# Altium project PCB Version 0.4.PrjPcb
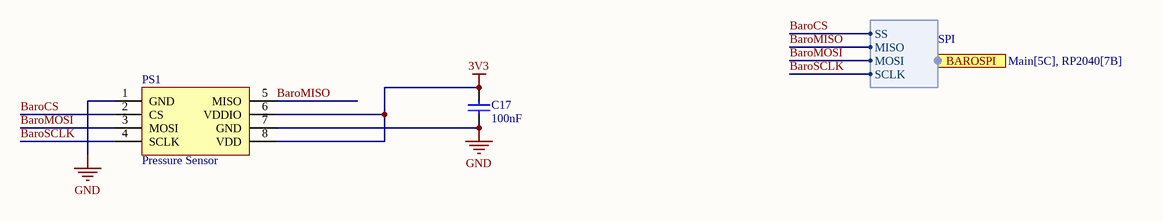
[diagram p0: Baro.SchDoc]
8 sheets, 151 parts. Net scope: flat (ports and power ports of the same name join across sheets).
Board file: PCB v0.4.PcbDoc
Sheets:
  Baro.SchDoc
  Connectors.SchDoc
  ELRS.SchDoc
  OSD.SchDoc
  RP2040.SchDoc
  SD.SchDoc
  USB.SchDoc
  Voltage Regulators.SchDoc

## Sheet Baro.SchDoc
size A4; SheetNumber: 2; SheetTotal: 13

### Parts
C17  100nF  [0402 cap]
PS1  Pressure Sensor  [Goertek SPL06-001]

### Ports
BAROSPI (harness SPI, see Main[5C], RP2040[7B])

### Harnesses
SPI: SS, MISO, MOSI, SCLK

### Nets
3V3: C17.2 PS1.6(VDDIO) PS1.8(VDD)
GND: C17.1 PS1.1(GND) PS1.7(GND)
BaroCS: PS1.2(CS) ; port BAROSPI.SS  [project net BARO_SS]
BaroMISO: PS1.5(MISO) ; port BAROSPI.MISO
BaroMOSI: PS1.3(MOSI) ; port BAROSPI.MOSI
BaroSCLK: PS1.4(SCLK) ; port BAROSPI.SCLK

### Library data of the parts
C17 = Capacitor 0402 100nF: Value: 100nF
PS1 = Goertek SPL06-001

## Sheet Connectors.SchDoc
size A4; SheetNumber: 3; SheetTotal: 13
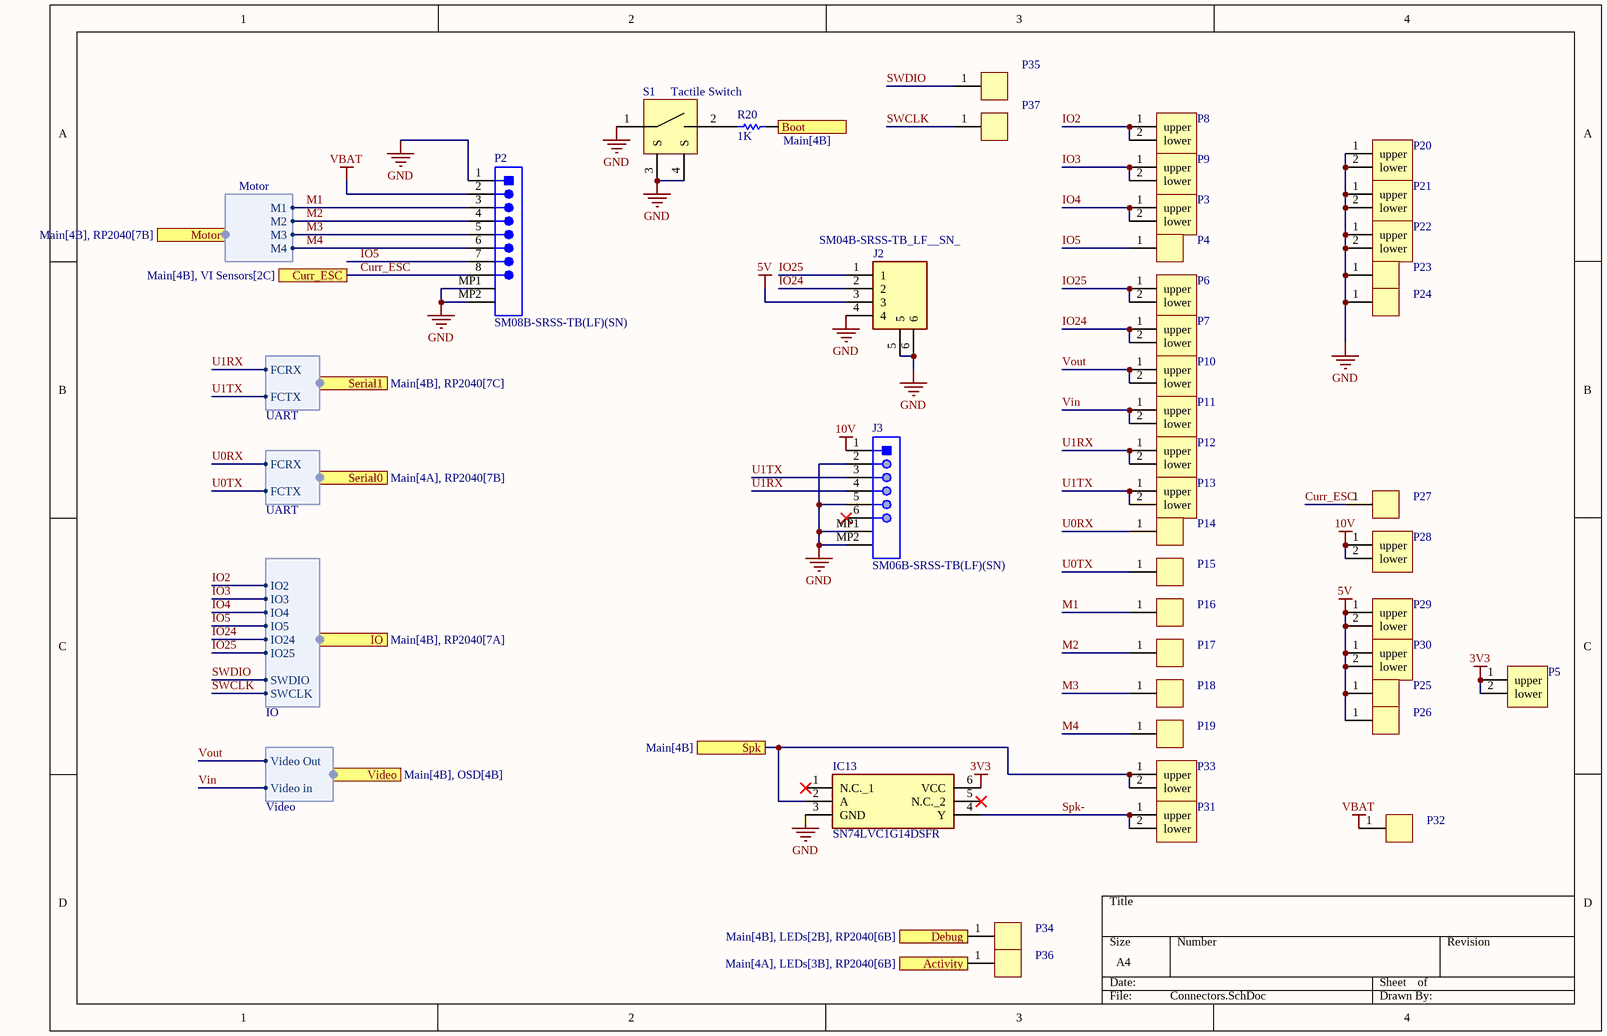
[diagram p1: Connectors.SchDoc]

### Parts
IC13  SN74LVC1G14DSFR  [SON35P100X100X40-6N]
J2  SM04B-SRSS-TB_LF__SN_  [SM04B-SRSS-TB(LFSN)]
J3  SM06B-SRSS-TB(LF)(SN)  [JST-SM06B-SRSS-TB_V]
P2  SM08B-SRSS-TB(LF)(SN)  [JST-SM08B-SRSS-TB_V]
P3  solder pad rounded double sided  [solder pad double sided rounded - duplicate]  (value not drawn)
P4  solder pad rounded single sided  [solder pad single sided rounded]  (value not drawn)
P5  solder pad chamfered double sided  [solder pad double sided chamfered]  (value not drawn)
P6  solder pad rounded double sided  [solder pad double sided rounded - duplicate]  (value not drawn)
P7  solder pad rounded double sided  [solder pad double sided rounded - duplicate]  (value not drawn)
P8  solder pad rounded double sided  [solder pad double sided rounded - duplicate]  (value not drawn)
P9  solder pad rounded double sided  [solder pad double sided rounded - duplicate]  (value not drawn)
P10  solder pad rounded double sided  [solder pad double sided rounded - duplicate]  (value not drawn)
P11  solder pad rounded double sided  [solder pad double sided rounded - duplicate]  (value not drawn)
P12  solder pad rounded double sided  [solder pad double sided rounded - duplicate]  (value not drawn)
P13  solder pad rounded double sided  [solder pad double sided rounded - duplicate]  (value not drawn)
P14  solder pad rounded single sided  [solder pad single sided rounded]  (value not drawn)
P15  solder pad rounded single sided  [solder pad single sided rounded]  (value not drawn)
P16  solder pad rounded single sided  [solder pad single sided rounded]  (value not drawn)
P17  solder pad rounded single sided  [solder pad single sided rounded]  (value not drawn)
P18  solder pad rounded single sided  [solder pad single sided rounded]  (value not drawn)
P19  solder pad rounded single sided  [solder pad single sided rounded]  (value not drawn)
P20  solder pad square double sided  [solder pad double sided square]  (value not drawn)
P21  solder pad square double sided  [solder pad double sided square]  (value not drawn)
P22  solder pad square double sided  [solder pad double sided square]  (value not drawn)
P23  solder pad square single sided  [solder pad single sided square]  (value not drawn)
P24  solder pad square single sided  [solder pad single sided square]  (value not drawn)
P25  solder pad chamfered single sided  [solder pad single sided chamfered]  (value not drawn)
P26  solder pad chamfered single sided  [solder pad single sided chamfered]  (value not drawn)
P27  solder pad rounded single sided  [solder pad single sided rounded]  (value not drawn)
P28  solder pad chamfered double sided  [solder pad double sided chamfered]  (value not drawn)
P29  solder pad chamfered double sided  [solder pad double sided chamfered]  (value not drawn)
P30  solder pad chamfered double sided  [solder pad double sided chamfered]  (value not drawn)
P31  solder pad rounded double sided  [solder pad double sided rounded - duplicate]  (value not drawn)
P32  solder pad chamfered single sided  [solder pad single sided chamfered]  (value not drawn)
P33  solder pad rounded double sided  [solder pad double sided rounded - duplicate]  (value not drawn)
P34  solder pad rounded single sided  [solder pad single sided rounded]  (value not drawn)
P35  solder pad rounded single sided  [solder pad single sided rounded]  (value not drawn)
P36  solder pad rounded single sided  [solder pad single sided rounded]  (value not drawn)
P37  solder pad rounded single sided  [solder pad single sided rounded]  (value not drawn)
R20  1K  [RESC0603(1608)_N]
S1  Tactile Switch  [Tactile Switch]

### Ports
Activity (see Main[4A], LEDs[3B], RP2040[6B]), Boot (see Main[4B]), Curr_ESC (see Main[4B], VI Sensors[2C]), Debug (see Main[4B], LEDs[2B], RP2040[6B]), IO (harness IO, see Main[4B], RP2040[7A]), Motor (harness Motor, see Main[4B], RP2040[7B]), Serial0 (harness UART, see Main[4A], RP2040[7B]), Serial1 (harness UART, see Main[4B], RP2040[7C]), Spk (see Main[4B]), Video (harness Video, see Main[4B], OSD[4B])

### Harnesses
Motor: M1, M2, M3, M4
UART: FCRX, FCTX
IO: IO24, IO25, SWDIO, SWCLK, IO4, IO5, IO2, IO3
Video: Video Out, Video in

### Nets
3V3: IC13.6(VCC) P5.1(upper) P5.2(lower)
5V: J2.3 P25.1(upper) P26.1(upper) P29.1(upper) P29.2(lower) P30.1(upper) P30.2(lower)
10V: J3.1 P28.1(upper) P28.2(lower)
GND: IC13.3(GND) J2.4 J2.5 J2.6 J3.2 J3.5 J3.MP1 J3.MP2 P2.1 P2.MP1 P2.MP2 P20.1(upper) P20.2(lower) P21.1(upper) P21.2(lower) P22.1(upper) P22.2(lower) P23.1(upper) P24.1(upper) S1.1 S1.3(S) S1.4(S)
VBAT: P2.2 P32.1(upper)
Activity: P36.1(upper) ; port Activity
Curr_ESC: P2.8 P27.1(upper) ; port Curr_ESC
Debug: P34.1(upper) ; port Debug
IO2: P8.1(upper) P8.2(lower) ; port IO.IO2
IO3: P9.1(upper) P9.2(lower) ; port IO.IO3
IO4: P3.1(upper) P3.2(lower) ; port IO.IO4
IO5: P2.7 P4.1(upper) ; port IO.IO5
IO24: J2.2 P7.1(upper) P7.2(lower) ; port IO.IO24
IO25: J2.1 P6.1(upper) P6.2(lower) ; port IO.IO25
M1: P2.3 P16.1(upper) ; port Motor.M1
M2: P2.4 P17.1(upper) ; port Motor.M2
M3: P2.5 P18.1(upper) ; port Motor.M3
M4: P2.6 P19.1(upper) ; port Motor.M4
Spk-: IC13.4(Y) P31.1(upper) P31.2(lower)
SWCLK: P37.1(upper) ; port IO.SWCLK
SWDIO: P35.1(upper) ; port IO.SWDIO
U0RX: P14.1(upper) ; port Serial0.FCRX
U0TX: P15.1(upper) ; port Serial0.FCTX
U1RX: J3.4 P12.1(upper) P12.2(lower) ; port Serial1.FCRX
U1TX: J3.3 P13.1(upper) P13.2(lower) ; port Serial1.FCTX
Vin: P11.1(upper) P11.2(lower) ; port Video.Video in  [project net Video In]
Vout: P10.1(upper) P10.2(lower) ; port Video.Video Out  [project net Video Out]
NetIC13_2: IC13.2(A) P33.1(upper) P33.2(lower) ; port Spk
NetR20_1: R20.1 S1.2
NetR20_2: R20.2 ; port Boot

Not connected (* = marked no-connect by the designer): IC13 1(N.C._1)* 5(N.C._2)*; J3 6*

### Library data of the parts
IC13 = SN74LVC1G14DSFR: Integrated Circuit; Manufacturer_Name: Texas Instruments; Datasheet Link: https://www.ti.com/lit/ds/symlink/sn74lvc1g14.pdf?HQS=dis-dk-null-digikeymode-dsf-pf-null-wwe&ts=1640194498042&ref_url=https%253A%252F%252Fwww.ti.com%252Fgeneral%252Fdocs%252Fsuppproductinfo.tsp%253FdistId%253D10%2526gotoUrl%253Dhttps%253A%252F%252Fwww.ti; Height: 0.4mm; Manufacturer_Part_Number: SN74LVC1G14DSFR; Mouser Part Number: 595-SN74LVC1G14DSFR; Mouser Price/Stock: https://www.mouser.co.uk/ProductDetail/Texas-Instruments/SN74LVC1G14DSFR?qs=L4ss%2FyqpMWRLGwmM%2Fw1SHQ%3D%3D; Arrow Part Number: SN74LVC1G14DSFR; Arrow Price/Stock: https://www.arrow.com/en/products/sn74lvc1g14dsfr/texas-instruments?region=nac
J2 = SM04B-SRSS-TB_LF__SN_: Connector; Manufacturer_Name: JST (JAPAN SOLDERLESS TERMINALS); Manufacturer_Part_Number: SM04B-SRSS-TB(LF)(SN); Datasheet Link: http://www.jst-mfg.com/product/pdf/eng/eSH.pdf; Arrow Part Number: SM04B-SRSS-TB(LF)(SN); Arrow Price/Stock: https://www.arrow.com/en/products/sm04b-srss-tb-lf-sn/jst-manufacturing?region=europe
J3 = CMP-2000-07080-1: Male Header, Pitch 1 mm, 1 x 6 Position, Height 2.95 mm, -25 to 85 degC, RoHS, Tape and Reel; Manufacturer: JST; No of Positions: 6; Pitch: 1mm; Style/Orientation: RightAngleHeader/Plug; Datasheet URL: https://datasheet.ciiva.com/26894/getdatasheetpartid-708885-26894671.pdf; Package Description: Male Header, Pitch 1 mm, 1 X 6 Position, Height 2.9 mm; Termination: Solder; Manufacturer URL: http://www.jst.com/home2.html; Type: ShroudedHeader; Package Reference: SM06B-SRSS-TB; Datasheet Version: 11/2010; Mounting Technology: SurfaceMount
P2 = CMP-2000-07082-1: Male Header, Pitch 1 mm, 1 x 8 Position, Height 2.95 mm, -25 to 85 degC, RoHS, Tape and Reel; Manufacturer: JST; Style/Orientation: RightAngleHeader/Plug; Pitch: 1mm; No of Positions: 8; Manufacturer URL: http://www.jst.com/home2.html; Mounting Technology: SurfaceMount; Package Description: Male Header, Pitch 1 mm, 1 x 8 Position, Height 2.95 mm; Datasheet URL: http://www.jst-mfg.com/product/pdf/eng/eSR.pdf; Type: ShroudedHeader; Termination: Crimp; Package Reference: SM08B-SRSS-TB; Datasheet Version: 11/2010
R20 = Res 1K: Chipwiderstand, SMD, Baureihe MC, 1%; Manufacturer: Multicomp; PackageReference: 0603; Value: 1K; OC_FARNELL: 9330380

## Sheet ELRS.SchDoc
size A3; SheetNumber: 4; SheetTotal: 13; SPICEModelCacheIXSEWQWZ: <root> / <DocumentId>IXSEWQWZ</DocumentId> / <CacheFrame Number="0"> / <Model Name="0603_885012106031_10uf" Kind="CKT"> / <Text>******* / .subckt 0603_885012106031_10uF 1 2 / Rser 1 3 0.0105 / Lser 2 4 0.0000000008 / C1 3 4 0.00001 / Rpar 3 4 10000000 / .ends 0603_885012106031_10uF</Text> / </Model> / </CacheFrame> / </root>
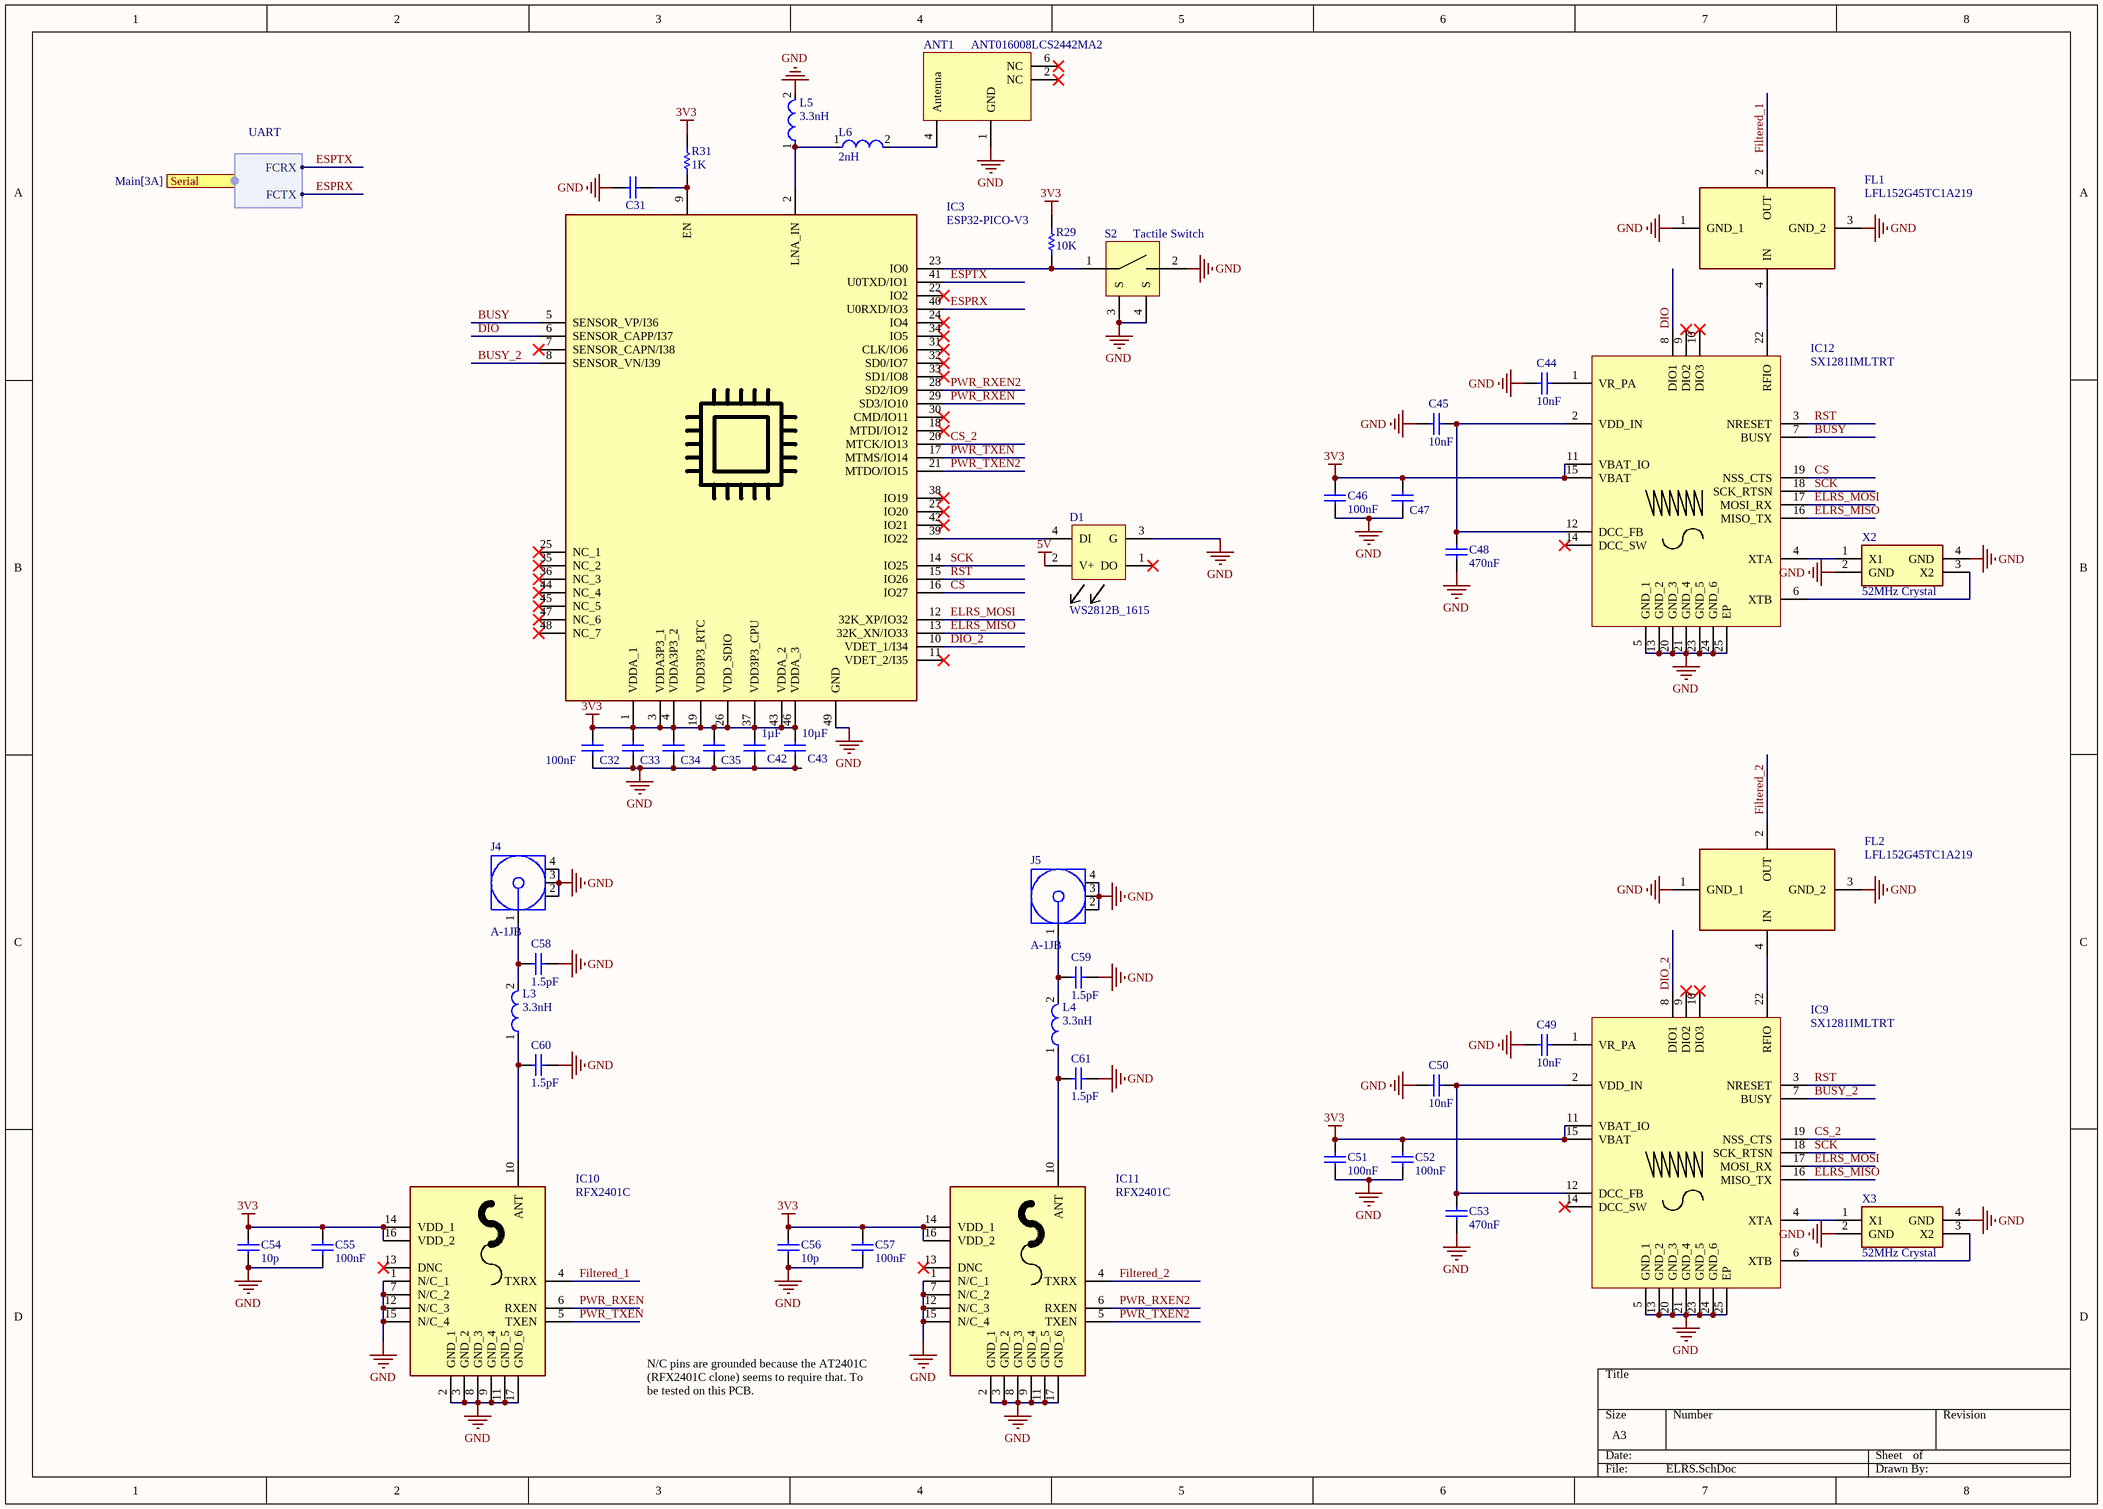
[diagram p2: ELRS.SchDoc]

### Parts
ANT1  ANT016008LCS2442MA2  [ANT016008LCS2442MA2]
C31  100nF  [WCAP-CSGP_0603_L1.6W0.8H0.8_Reflow]  (value not drawn)
C32  100nF  [WCAP-CSGP_0603_L1.6W0.8H0.8_Reflow]
C33  100nF  [WCAP-CSGP_0603_L1.6W0.8H0.8_Reflow]  (value not drawn)
C34  100nF  [WCAP-CSGP_0603_L1.6W0.8H0.8_Reflow]  (value not drawn)
C35  100nF  [WCAP-CSGP_0603_L1.6W0.8H0.8_Reflow]  (value not drawn)
C42  1µF  [WCAP-CSGP_0603_L1.6W0.8H0.8_Reflow]
C43  10µF  [WCAP-CSGP_0603_L1.6W0.8H0.8_Reflow]
C44  10nF  [0402 cap]
C45  10nF  [0402 cap]
C46  100nF  [0402 cap]
C47  100nF  [WCAP-CSGP_0603_L1.6W0.8H0.8_Reflow]  (value not drawn)
C48  470nF  [0402 cap]
C49  10nF  [0402 cap]
C50  10nF  [0402 cap]
C51  100nF  [0402 cap]
C52  100nF  [0402 cap]
C53  470nF  [0402 cap]
C54  10p  [0402 cap]
C55  100nF  [0402 cap]
C56  10p  [0402 cap]
C57  100nF  [0402 cap]
C58  1.5pF  [0402 cap]
C59  1.5pF  [0402 cap]
C60  1.5pF  [0402 cap]
C61  1.5pF  [0402 cap]
D1  WS2812B_1615  [WS2812B_1615]
FL1  LFL152G45TC1A219  [LFL152G45TC1A219]
FL2  LFL152G45TC1A219  [LFL152G45TC1A219]
IC3  ESP32-PICO-V3  [ESP32PICOV3]
IC9  SX1281IMLTRT  [QFN50P400X400X100-25N-D]
IC10  RFX2401C  [QFN50P300X300X60-17N-D]
IC11  RFX2401C  [QFN50P300X300X60-17N-D]
IC12  SX1281IMLTRT  [QFN50P400X400X100-25N-D]
J4  A-1JB  [AMPH-A-1JB_V]
J5  A-1JB  [AMPH-A-1JB_V]
L3  3.3nH  [FP-LQW15AN_00-W0_6-0_1-MFG]
L4  3.3nH  [FP-LQW15AN_00-W0_6-0_1-MFG]
L5  3.3nH  [FP-LQW15AN_00-W0_6-0_1-MFG]
L6  2nH  [FP-LQW15AN_00-W0_6-0_1-MFG]
R29  10K  [0402 resistor]
R31  1K  [0402 resistor]
S2  Tactile Switch  [Tactile Switch]
X2  52MHz Crystal  [2016 Crystal]
X3  52MHz Crystal  [2016 Crystal]

### Ports
Serial (harness UART, see Main[3A])

### Harnesses
UART: FCRX, FCTX

### Nets
3V3: C32.2 C33.2 C34.2 C35.2 C42.2 C43.2 C46.2 C47.2 C51.2 C52.2 C54.2 C55.2 C56.2 C57.2 IC3.1(VDDA_1) IC3.3(VDDA3P3_1) IC3.4(VDDA3P3_2) IC3.19(VDD3P3_RTC) IC3.26(VDD_SDIO) IC3.37(VDD3P3_CPU) IC3.43(VDDA_2) IC3.46(VDDA_3) IC9.11(VBAT_IO) IC9.15(VBAT) IC10.14(VDD_1) IC10.16(VDD_2) IC11.14(VDD_1) IC11.16(VDD_2) IC12.11(VBAT_IO) IC12.15(VBAT) R29.2 R31.2
5V: D1.2(V+)
GND: ANT1.1(GND) C31.2 C32.1 C33.1 C34.1 C35.1 C42.1 C43.1 C44.1 C45.1 C46.1 C47.1 C48.1 C49.1 C50.1 C51.1 C52.1 C53.1 C54.1 C55.1 C56.1 C57.1 C58.2 C59.2 C60.2 C61.2 D1.3(G) FL1.1(GND_1) FL1.3(GND_2) FL2.1(GND_1) FL2.3(GND_2) IC3.49(GND) IC9.5(GND_1) IC9.13(GND_2) IC9.20(GND_3) IC9.21(GND_4) IC9.23(GND_5) IC9.24(GND_6) IC9.25(EP) IC10.1(N/C_1) IC10.2(GND_1) IC10.3(GND_2) IC10.7(N/C_2) IC10.8(GND_3) IC10.9(GND_4) IC10.11(GND_5) IC10.12(N/C_3) IC10.15(N/C_4) IC10.17(GND_6) IC11.1(N/C_1) IC11.2(GND_1) IC11.3(GND_2) IC11.7(N/C_2) IC11.8(GND_3) IC11.9(GND_4) IC11.11(GND_5) IC11.12(N/C_3) IC11.15(N/C_4) IC11.17(GND_6) IC12.5(GND_1) IC12.13(GND_2) IC12.20(GND_3) IC12.21(GND_4) IC12.23(GND_5) IC12.24(GND_6) IC12.25(EP) J4.2 J4.3 J4.4 J5.2 J5.3 J5.4 L5.2 S2.2 S2.3(S) S2.4(S) X2.2(GND) X2.4(GND) X3.2(GND) X3.4(GND)
BUSY: IC3.5(SENSOR_VP/I36) IC12.7(BUSY)
BUSY_2: IC3.8(SENSOR_VN/I39) IC9.7(BUSY)
CS: IC3.16(IO27) IC12.19(NSS_CTS)
CS_2: IC3.20(MTCK/IO13) IC9.19(NSS_CTS)
DIO: IC3.6(SENSOR_CAPP/I37) IC12.8(DIO1)
DIO_2: IC3.10(VDET_1/I34) IC9.8(DIO1)
ELRS_MISO: IC3.13(32K_XN/IO33) IC9.16(MISO_TX) IC12.16(MISO_TX)
ELRS_MOSI: IC3.12(32K_XP/IO32) IC9.17(MOSI_RX) IC12.17(MOSI_RX)
ESPRX: IC3.40(U0RXD/IO3) ; port Serial.FCTX
ESPTX: IC3.41(U0TXD/IO1) ; port Serial.FCRX
Filtered_1: FL1.2(OUT) IC10.4(TXRX)
Filtered_2: FL2.2(OUT) IC11.4(TXRX)
PWR_RXEN: IC3.29(SD3/IO10) IC10.6(RXEN)
PWR_RXEN2: IC3.28(SD2/IO9) IC11.6(RXEN)
PWR_TXEN: IC3.17(MTMS/IO14) IC10.5(TXEN)
PWR_TXEN2: IC3.21(MTDO/IO15) IC11.5(TXEN)
RST: IC3.15(IO26) IC9.3(NRESET) IC12.3(NRESET)
SCK: IC3.14(IO25) IC9.18(SCK_RTSN) IC12.18(SCK_RTSN)
NetANT1_4: ANT1.4(Antenna) L6.2
NetC31_1: C31.1 IC3.9(EN) R31.1
NetC44_2: C44.2 IC12.1(VR_PA)
NetC45_2: C45.2 C48.2 IC12.2(VDD_IN) IC12.12(DCC_FB)
NetC49_2: C49.2 IC9.1(VR_PA)
NetC50_2: C50.2 C53.2 IC9.2(VDD_IN) IC9.12(DCC_FB)
NetC58_1: C58.1 J4.1 L3.2
NetC59_1: C59.1 J5.1 L4.2
NetC60_1: C60.1 IC10.10(ANT) L3.1
NetC61_1: C61.1 IC11.10(ANT) L4.1
NetD1_4: D1.4(DI) IC3.39(IO22)
NetFL1_4: FL1.4(IN) IC12.22(RFIO)
NetFL2_4: FL2.4(IN) IC9.22(RFIO)
NetIC3_2: IC3.2(LNA_IN) L5.1 L6.1
NetIC3_23: IC3.23(IO0) R29.1 S2.1
NetIC9_4: IC9.4(XTA) X3.1(X1)
NetIC9_6: IC9.6(XTB) X3.3(X2)
NetIC12_4: IC12.4(XTA) X2.1(X1)
NetIC12_6: IC12.6(XTB) X2.3(X2)

Not connected (* = marked no-connect by the designer): ANT1 2(NC)* 6(NC)*; D1 1(DO)*; IC3 7(SENSOR_CAPN/I38)* 11(VDET_2/I35)* 18(MTDI/IO12)* 22(IO2)* 24(IO4)* 25(NC_1)* 27(IO20)* 30(CMD/IO11)* 31(CLK/IO6)* 32(SD0/IO7)* 33(SD1/IO8)* 34(IO5)* 35(NC_2)* 36(NC_3)* 38(IO19)* 42(IO21)* 44(NC_4)* 45(NC_5)* 47(NC_6)* 48(NC_7)*; IC9 9(DIO2)* 10(DIO3)* 14(DCC_SW)*; IC10 13(DNC)*; IC11 13(DNC)*; IC12 9(DIO2)* 10(DIO3)* 14(DCC_SW)*

### Notes on the sheet
- N/C pins are grounded because the AT2401C (RFX2401C clone) seems to require that. To be tested on this PCB.

### Library data of the parts
ANT1 = ANT016008LCS2442MA2: Antenna; Manufacturer_Name: TDK; Datasheet Link: https://product.tdk.com/system/files/dam/doc/product/rf/rf/antenna/catalog/rf_ant_ant016008lcs2442ma2_summary_en.pdf; Height: 0.4mm; Manufacturer_Part_Number: ANT016008LCS2442MA2; Mouser Part Number: 810-ANT168LCS2442MA2; Mouser Price/Stock: https://www.mouser.co.uk/ProductDetail/TDK/ANT016008LCS2442MA2?qs=NlTBjZZh8j0h3jcBIFCiDg%3D%3D; Arrow Part Number: ANT016008LCS2442MA2; Arrow Price/Stock: https://www.arrow.com/en/products/ant016008lcs2442ma2/tdk
C31-C35 C47 = 885012206095: WCAP-CSGP Multilayer Ceramic Chip Capacitor, General Purpose, size 0603, X7R, 100nF, 50VDC; Manufacturer: Wurth Elektronik; Case/Size Code: 0603; Capacitance Tolerance: +/-10%; Dissipation Factor: 3%; Insulation Resistance: 5GΩ; Rated Voltage (DC): 50V; Technical Reference: X7R0603104K050DFCT10000; Manufacturer Part Number: 885012206095; Category: Multilayer Ceramic Chip Capacitors; Match Code: WCAP-CSGP; ComponentLink1Description: Website Link; ComponentLink1URL: https://www.we-online.com/redexpert/article/885012206095?ad; ComponentLink2Description: Datasheet Link; ComponentLink2URL: https://www.we-online.com/redexpert/spec/885012206095?ad; Mount: Surface Mount; Operating Temperature Max: 125°C; Operating Temperature Min: -55°C; Packaging: Tape and Reel; Length: 1.6mm; Width: 0.8mm; Height: 0.8mm; Capacitance: 100nF; Ceramic Type: X7R
C42 = 885012206076: WCAP-CSGP Multilayer Ceramic Chip Capacitor, General Purpose, size 0603, X7R, 1µF, 25VDC; Manufacturer: Wurth Elektronik; Case/Size Code: 0603; Capacitance Tolerance: +/-10%; Dissipation Factor: 10%; Insulation Resistance: 0.5GΩ; Rated Voltage (DC): 25V; Technical Reference: X7R0603105K025DFCT10000; Manufacturer Part Number: 885012206076; Category: Multilayer Ceramic Chip Capacitors; Match Code: WCAP-CSGP; ComponentLink1Description: Website Link; ComponentLink1URL: https://www.we-online.com/redexpert/article/885012206076?ad; ComponentLink2Description: Datasheet Link; ComponentLink2URL: https://www.we-online.com/redexpert/spec/885012206076?ad; Mount: Surface Mount; Operating Temperature Max: 125°C; Operating Temperature Min: -55°C; Packaging: Tape and Reel; Length: 1.6mm; Width: 0.8mm; Height: 0.8mm; Capacitance: 1µF; Ceramic Type: X7R
C43 = 885012106031: WCAP-CSGP Multilayer Ceramic Chip Capacitor, General Purpose, size 0603, X5R, 10µF, 25VDC; Manufacturer: Wurth Elektronik; Case/Size Code: 0603; Capacitance Tolerance: +/20%; Dissipation Factor: 20%; Insulation Resistance: 0.01GΩ; Rated Voltage (DC): 25V; Technical Reference: X5R0603106M025DFCT10000; Manufacturer Part Number: 885012106031; Category: Multilayer Ceramic Chip Capacitors; Match Code: WCAP-CSGP; ComponentLink1Description: Website Link; ComponentLink1URL: https://www.we-online.com/redexpert/article/885012106031?ad; ComponentLink2Description: Datasheet Link; ComponentLink2URL: https://www.we-online.com/redexpert/spec/885012106031?ad; Mount: Surface Mount; Operating Temperature Max: 85°C; Operating Temperature Min: -55°C; Packaging: Tape and Reel; Length: 1.6mm; Width: 0.8mm; Height: 0.8mm; Capacitance: 10µF; Ceramic Type: X5R
C44-C46 C48-C57 = Capacitor 0402 100nF
  C44 C45 C49 C50: Value: 10nF
  C46 C51 C52 C55 C57: Value: 100nF
  C48 C53: Value: 470nF
  C54 C56: Value: 10p
C58-C61 = Capacitor 0402 100nF: CL05C1R5BB5NNNC; Value: 1.5pF
D1 = WS2812B_1615: XINGLIGHT XL-1615RGBC-WS2812B
FL1 FL2 = LFL152G45TC1A219: Filter; Manufacturer_Name: Murata Electronics; Datasheet Link: https://www.murata.com/en-us/products/productdetail?partno=LFL152G45TC1A219; Height: 0.4mm; Manufacturer_Part_Number: LFL152G45TC1A219; Mouser Part Number: 81-LFL152G45TC1A219; Mouser Price/Stock: https://www.mouser.co.uk/ProductDetail/Murata-Electronics/LFL152G45TC1A219?qs=%2F%252BYoplLUB5hWhU%2FZs0btqg%3D%3D; Arrow Part Number: LFL152G45TC1A219; Arrow Price/Stock: https://www.arrow.com/en/products/lfl152g45tc1a219/murata-manufacturing?region=nac
IC3 = ESP32-PICO-V3: Integrated Circuit; Manufacturer_Name: Espressif Systems; Datasheet Link: https://kr.mouser.com/datasheet/2/891/esp32-pico-v3_datasheet_en-1842685.pdf; Height: 1.04mm; Manufacturer_Part_Number: ESP32-PICO-V3; Mouser Part Number: 356-ESP32-PICO-V3; Mouser Price/Stock: https://www.mouser.co.uk/ProductDetail/Espressif-Systems/ESP32-PICO-V3?qs=GBLSl2Akirs311o8knsnZA%3D%3D
IC9 IC12 = SX1281IMLTRT: Integrated Circuit; Manufacturer_Name: SEMTECH; Datasheet Link: https://www.arrow.com/en/products/sx1281imltrt/semtech; Height: 1mm; Manufacturer_Part_Number: SX1281IMLTRT; Mouser Part Number: 947-SX1281IMLTRT; Mouser Price/Stock: https://www.mouser.co.uk/ProductDetail/Semtech/SX1281IMLTRT?qs=5aG0NVq1C4xR1aFoShVcjg%3D%3D; Arrow Part Number: SX1281IMLTRT; Arrow Price/Stock: https://www.arrow.com/en/products/sx1281imltrt/semtech?region=nac
IC10 IC11 = RFX2401C: Integrated Circuit; Manufacturer_Name: Skyworks; Datasheet Link: https://eu.mouser.com/datasheet/2/472/RFX2401C_204359B-1524606.pdf; Height: 0.6mm; Manufacturer_Part_Number: RFX2401C; Mouser Part Number: 477-RFX2401C; Mouser Price/Stock: https://www.mouser.co.uk/ProductDetail/Skyworks-Solutions-Inc/RFX2401C?qs=dBWc1juS%252B3ydEXrKsuxQ7A%3D%3D
J4 J5 = CMP-1743-00001-1: AMC PCB Jack, 0 to 60 GHz, 60 V, -40 to 90 degC, 4-Pin SMD, RoHS, Tape and Reel; Capacitance: 100 uF; Case\Package: 2917; Voltage Rating (DC): 10 V; ESR: 700 mohm; Tolerance: 10%; ComponentLink1Description: Datasheet; PackageDescription: 4-Pin Surface Mount Device, Body 2.6 x 2.6 mm; Radiation Hardening: No; Package Quantity: 1; REACH SVHC: No SVHC; DatasheetVersion: Rev. K, 05/2016; ComponentLink1URL: http://drawings.amphenolrf.com/Customer_Outline/CA-1JB.pdf; Pins: 2; Packaging: Tape and Reel; Min Operating Temperature: -55 degC; RoHSCompliant: true; Length: 7.3 mm; PackageReference: A-1JB; Weight: 0.023634 oz; Mount: Surface Mount; Voltage Rating: 10 V; Max Operating Temperature: 125 degC; Height: 3.1 mm; Case Code (Imperial): 2917; Case Code (Metric): 7343; Width: 4.3 mm
L3-L6 = CMP-06042-000827-1: MLG1005S3N3BT000; Inductance: 3.9nH; Shielding: Unshielded; Self Resonant Frequency: 10GHz; Core Material: Air; Current: 750mA; Test Frequency: 100MHz; DC Resistance (DCR): 70mR; Length: 1mm; Height: 0.5mm; Case Code (Metric): 1005; Lead Free: Lead Free; Military Standard: Not; Mount: Surface Mount; REACH SVHC: No SVHC; Current Rating: 750mA; DC Current: 750mA; Max Operating Temperature: 125°C; Package Quantity: 10000; Packaging: Tape and Reel; Case/Package: 0402; Min Operating Temperature: -55°C; Width: 0.02inch; Depth: 0.7mm; Termination: SMD/SMT; Weight: 2.8E-05oz; Number of Pins: 2; Radiation Hardening: No; Max DC Current: 750mA; Case Code (Imperial): 0402
R29 R31 = Resistor 0402 1K
  R29: Value: 10K
  R31: Value: 1K
X2 X3 = HCI XC21M4-52.000: HCI XC21M4-52.000-F10NNHPL

## Sheet OSD.SchDoc
size A4; SheetNumber: 8; SheetTotal: 13
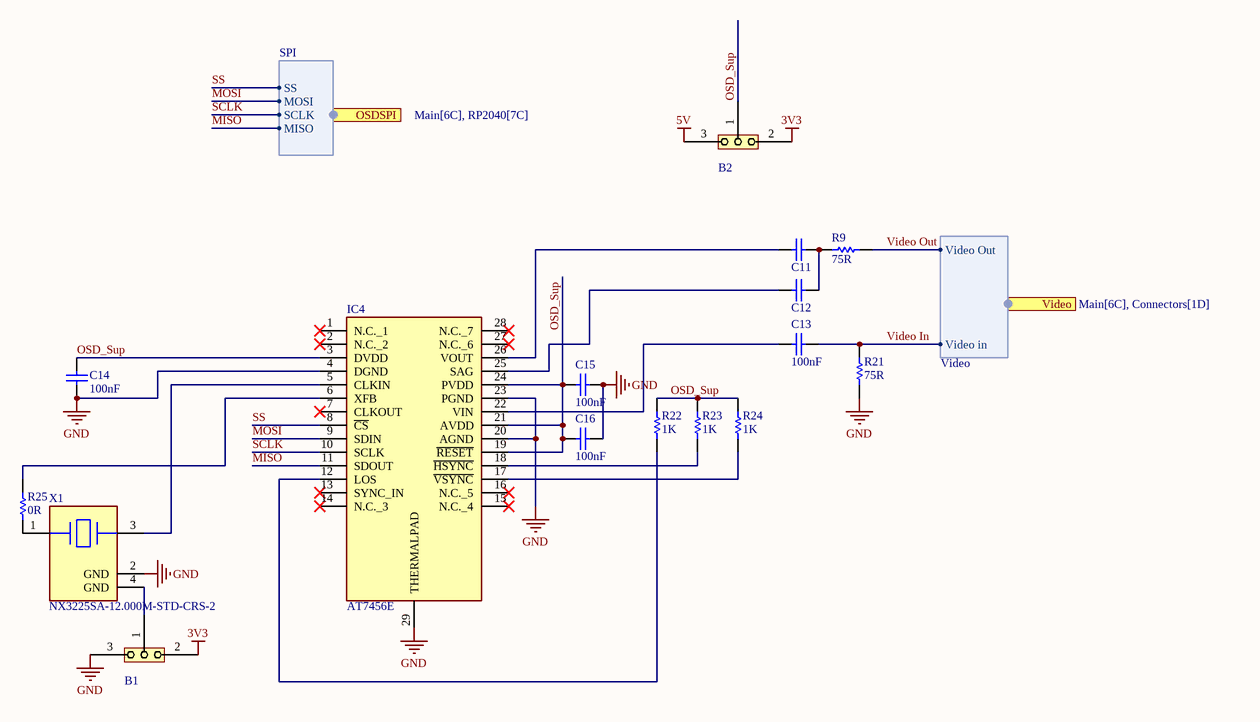
[diagram p3: OSD.SchDoc]

### Parts
B1  0402 Solder Bridge  [0402 triple Solderbridge]  (value not drawn)
B2  0402 Solder Bridge  [0402 triple Solderbridge]  (value not drawn)
C11  10µF  [WCAP-CSGP_0603_L1.6W0.8H0.8_Reflow]  (value not drawn)
C12  10µF  [WCAP-CSGP_0603_L1.6W0.8H0.8_Reflow]  (value not drawn)
C13  100nF  [0402 cap]
C14  100nF  [0402 cap]
C15  100nF  [0402 cap]
C16  100nF  [0402 cap]
IC4  AT7456E  [SOP65P640X120-29N]
R9  75R  [0402 resistor]
R21  75R  [0402 resistor]
R22  1K  [0402 resistor]
R23  1K  [0402 resistor]
R24  1K  [0402 resistor]
R25  0R  [0402 resistor]
X1  NX3225SA-12.000M-STD-CRS-2  [FP-NX3225SA-MFG]

### Ports
OSDSPI (harness SPI, see Main[6C], RP2040[7C]), Video (harness Video, see Main[6C], Connectors[1D])

### Harnesses
SPI: SS, MOSI, SCLK, MISO
Video: Video Out, Video in

### Nets
3V3: B1.2 B2.2
5V: B2.3
GND: B1.3 C14.1 C15.2 C16.2 IC4.4(DGND) IC4.20(AGND) IC4.23(PGND) IC4.29(THERMALPAD) R21.2 X1.2(GND)
MISO: IC4.11(SDOUT) ; port OSDSPI.MISO  [project net BaroMISO]
MOSI: IC4.9(SDIN) ; port OSDSPI.MOSI  [project net BaroMOSI]
OSD_Sup: B2.1 C14.2 C15.1 C16.1 IC4.3(DVDD) IC4.19(~{RESET}) IC4.21(AVDD) IC4.24(PVDD) R22.2 R23.2 R24.2
SCLK: IC4.10(SCLK) ; port OSDSPI.SCLK  [project net BaroSCLK]
SS: IC4.8(~{CS}) ; port OSDSPI.SS  [project net OSD_SS]
Video In: C13.2 R21.1 ; port Video.Video in
Video Out: R9.1 ; port Video.Video Out
NetB1_1: B1.1 X1.4(GND)
NetC11_1: C11.1 IC4.26(VOUT)
NetC11_2: C11.2 C12.2 R9.2
NetC12_1: C12.1 IC4.25(SAG)
NetC13_1: C13.1 IC4.22(VIN)
NetIC4_5: IC4.5(CLKIN) X1.3
NetIC4_6: IC4.6(XFB) R25.2
NetIC4_12: IC4.12(LOS) R22.1
NetIC4_17: IC4.17(~{VSYNC}) R24.1
NetIC4_18: IC4.18(~{HSYNC}) R23.1
NetR25_1: R25.1 X1.1

Not connected (* = marked no-connect by the designer): IC4 1(N.C._1)* 2(N.C._2)* 7(CLKOUT)* 13(SYNC_IN)* 14(N.C._3)* 15(N.C._4)* 16(N.C._5)* 27(N.C._6)* 28(N.C._7)*

### Library data of the parts
C11 C12 = 885012106031: as C43 on sheet ELRS; ComponentLink1Description: Website Link; ComponentLink1URL: https://www.we-online.com/redexpert/article/885012106031?ad; ComponentLink2Description: Datasheet Link; ComponentLink2URL: https://www.we-online.com/redexpert/spec/885012106031?ad; Manufacturer Part Number: 885012106031; Category: Multilayer Ceramic Chip Capacitors; Match Code: WCAP-CSGP; Mount: Surface Mount; Operating Temperature Max: 85°C; Operating Temperature Min: -55°C; Packaging: Tape and Reel; Length: 1.6mm; Width: 0.8mm; Height: 0.8mm; Capacitance: 10µF; Ceramic Type: X5R
C13-C16 = Capacitor 0402 100nF: Value: 100nF
IC4 = AT7456E: Integrated Circuit; Manufacturer_Name: ICOF; Datasheet Link: https://datasheet.lcsc.com/szlcsc/ZHONGKEWEI-AT7456E_C82351.pdf; Height: 1.2mm; Manufacturer_Part_Number: AT7456E
R9 R21-R25 = Resistor 0402 1K
  R9 R21: Value: 75R
  R22-R24: Value: 1K
  R25: Value: 0R
X1 = CMP-200220-000016-1: Frequency Tolerance: 15ppm; Frequency: 12MHz; Frequency Stability: 50ppm; ESR (Equivalent Series Resistance): 120R; Load Capacitance: 8pF; Case/Package: SMD/SMT; RoHS Compliant: Yes; Mount: Surface Mount; Ratings: AEC-Q200; Length: 0.126inch; Packaging: Tape and Reel; Width: 0.098inch; Min Operating Temperature: -40°C; Height: 0.024inch; Max Operating Temperature: 125°C

## Sheet RP2040.SchDoc
size A3; SheetNumber: 9; SheetTotal: 13; SPICEModelCacheJQUAOKPN: <root> / <DocumentId>JQUAOKPN</DocumentId> / <CacheFrame Number="0"> / <Model Name="0402_885012205086_100nf" Kind="CKT"> / <Text>******* / .subckt 0402_885012205086_100nF 1 2 / Rser 1 3 0.07 / Lser 2 4 0.00000000055 / C1 3 4 0.0000001 / Rpar 3 4 1000000000 / .ends 0402_885012205086_100nF</Text> / </Model> / </CacheFrame> / </root>
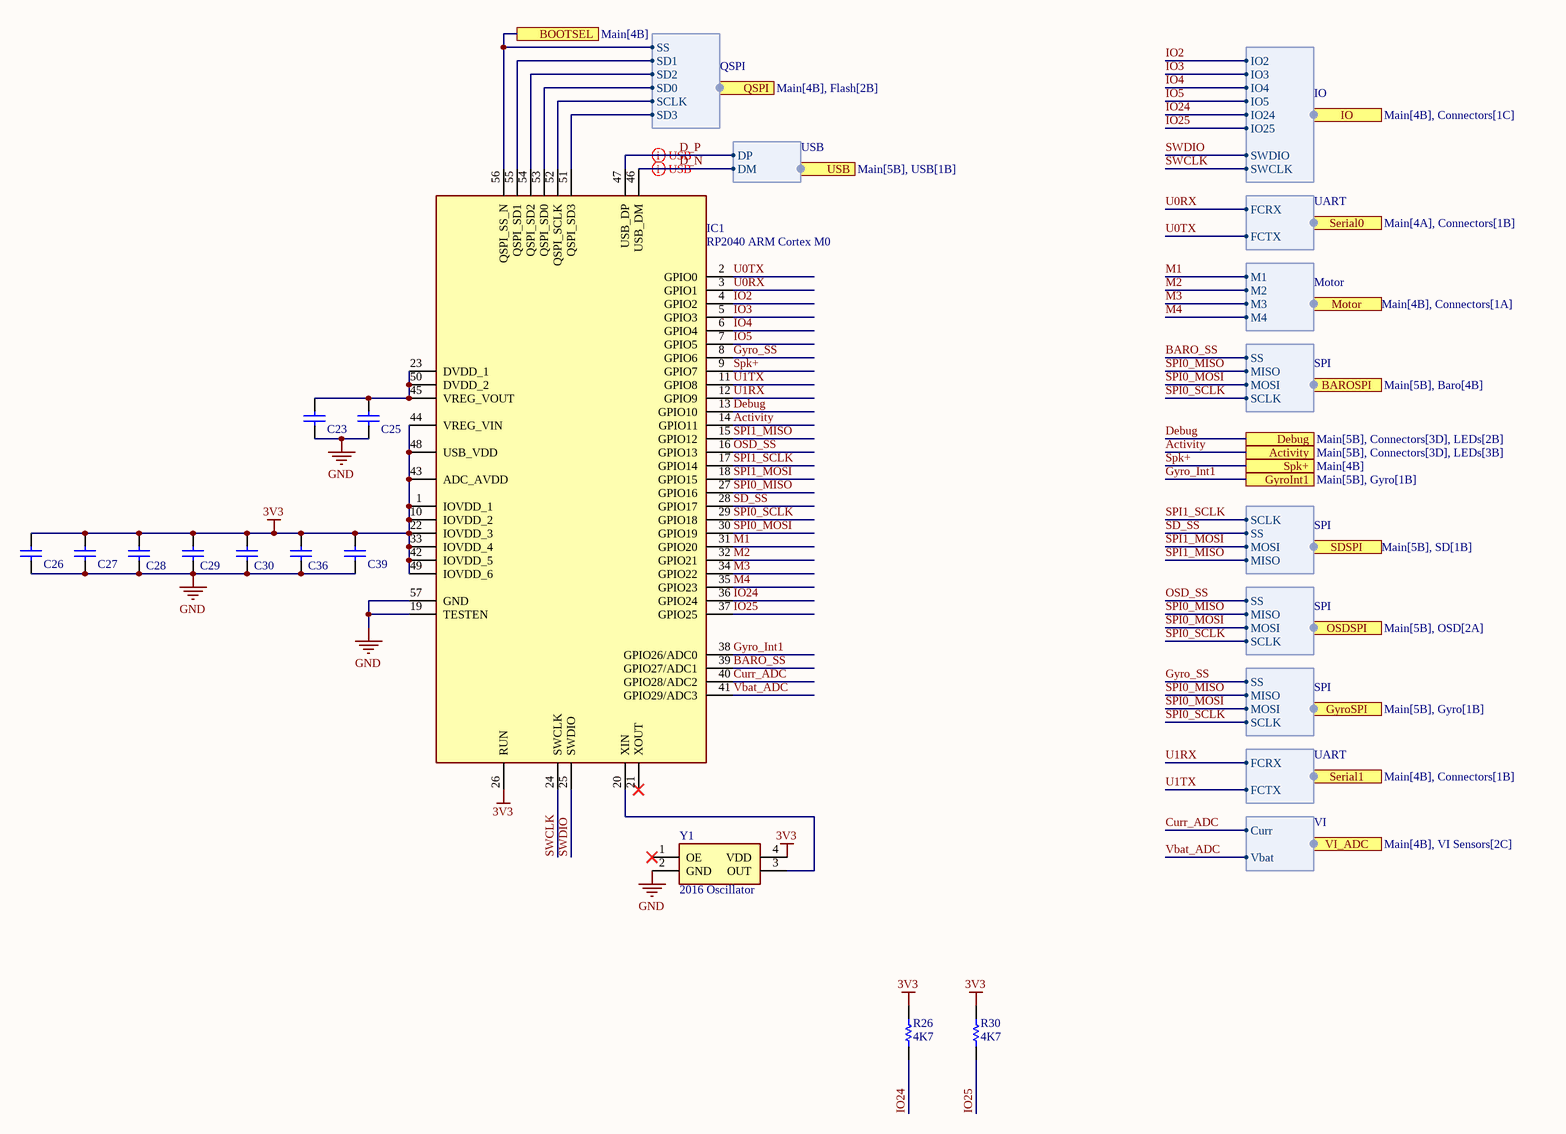
[diagram p4: RP2040.SchDoc]

### Parts
C23  100nF  [WCAP-CSGP_0402_L1W0.5H0.5]  (value not drawn)
C25  100nF  [WCAP-CSGP_0402_L1W0.5H0.5]  (value not drawn)
C26  100nF  [WCAP-CSGP_0402_L1W0.5H0.5]  (value not drawn)
C27  100nF  [WCAP-CSGP_0402_L1W0.5H0.5]  (value not drawn)
C28  100nF  [WCAP-CSGP_0603_L1.6W0.8H0.8_Reflow]  (value not drawn)
C29  100nF  [WCAP-CSGP_0603_L1.6W0.8H0.8_Reflow]  (value not drawn)
C30  100nF  [WCAP-CSGP_0603_L1.6W0.8H0.8_Reflow]  (value not drawn)
C36  100nF  [WCAP-CSGP_0603_L1.6W0.8H0.8_Reflow]  (value not drawn)
C39  100nF  [WCAP-CSGP_0402_L1W0.5H0.5]  (value not drawn)
IC1  RP2040 ARM Cortex M0  [SC091413]
R26  4K7  [RESC0603(1608)_N]
R30  4K7  [RESC0603(1608)_N]
Y1  2016 Oscillator  [2016 Oscillator]

### Ports
Activity (see Main[5B], Connectors[3D], LEDs[3B]), BAROSPI (harness SPI, see Main[5B], Baro[4B]), BOOTSEL (see Main[4B]), Debug (see Main[5B], Connectors[3D], LEDs[2B]), GyroInt1 (see Main[5B], Gyro[1B]), GyroSPI (harness SPI, see Main[5B], Gyro[1B]), IO (harness IO, see Main[4B], Connectors[1C]), Motor (harness Motor, see Main[4B], Connectors[1A]), OSDSPI (harness SPI, see Main[5B], OSD[2A]), QSPI (harness QSPI, see Main[4B], Flash[2B]), SDSPI (harness SPI, see Main[5B], SD[1B]), Serial0 (harness UART, see Main[4A], Connectors[1B]), Serial1 (harness UART, see Main[4B], Connectors[1B]), Spk+ (see Main[4B]), USB (harness USB, see Main[5B], USB[1B]), VI_ADC (harness VI, see Main[4B], VI Sensors[2C])

### Harnesses
QSPI: SS, SD1, SD2, SD0, SCLK, SD3
USB: DP, DM
SPI: SS, MISO, MOSI, SCLK
UART: FCRX, FCTX
Motor: M2, M4, M1, M3
VI: Curr, Vbat
IO: IO24, IO25, SWDIO, SWCLK, IO4, IO5, IO3, IO2
SPI: MISO, MOSI, SS, SCLK

### Nets
3V3: C26.2 C27.2 C28.2 C29.2 C30.2 C36.2 C39.2 IC1.1(IOVDD_1) IC1.10(IOVDD_2) IC1.22(IOVDD_3) IC1.26(RUN) IC1.33(IOVDD_4) IC1.42(IOVDD_5) IC1.43(ADC_AVDD) IC1.44(VREG_VIN) IC1.48(USB_VDD) IC1.49(IOVDD_6) R26.2 R30.2 Y1.4(VDD)
GND: C23.1 C25.1 C26.1 C27.1 C28.1 C29.1 C30.1 C36.1 C39.1 IC1.19(TESTEN) IC1.57(GND) Y1.2(GND)
Activity: IC1.14(GPIO11) ; port Activity
BARO_SS: IC1.39(GPIO27/ADC1) ; port BAROSPI.SS
Curr_ADC: IC1.40(GPIO28/ADC2) ; port VI_ADC.Curr
D_N: IC1.46(USB_DM) ; port USB.DM
D_P: IC1.47(USB_DP) ; port USB.DP
Debug: IC1.13(GPIO10) ; port Debug
Gyro_Int1: IC1.38(GPIO26/ADC0) ; port GyroInt1
Gyro_SS: IC1.8(GPIO6) ; port GyroSPI.SS
IO2: IC1.4(GPIO2) ; port IO.IO2
IO3: IC1.5(GPIO3) ; port IO.IO3
IO4: IC1.6(GPIO4) ; port IO.IO4
IO5: IC1.7(GPIO5) ; port IO.IO5
IO24: IC1.36(GPIO24) R26.1 ; port IO.IO24
IO25: IC1.37(GPIO25) R30.1 ; port IO.IO25
M1: IC1.31(GPIO20) ; port Motor.M1
M2: IC1.32(GPIO21) ; port Motor.M2
M3: IC1.34(GPIO22) ; port Motor.M3
M4: IC1.35(GPIO23) ; port Motor.M4
OSD_SS: IC1.16(GPIO13) ; port OSDSPI.SS
SD_SS: IC1.28(GPIO17) ; port SDSPI.SS
SPI0_MISO: IC1.27(GPIO16) ; port BAROSPI.MISO, port OSDSPI.MISO, port GyroSPI.MISO  [project net BaroMISO]
SPI0_MOSI: IC1.30(GPIO19) ; port BAROSPI.MOSI, port OSDSPI.MOSI, port GyroSPI.MOSI  [project net BaroMOSI]
SPI0_SCLK: IC1.29(GPIO18) ; port BAROSPI.SCLK, port OSDSPI.SCLK, port GyroSPI.SCLK  [project net BaroSCLK]
SPI1_MISO: IC1.15(GPIO12) ; port SDSPI.MISO  [project net SDMISO]
SPI1_MOSI: IC1.18(GPIO15) ; port SDSPI.MOSI  [project net SDMOSI]
SPI1_SCLK: IC1.17(GPIO14) ; port SDSPI.SCLK  [project net SDSCLK]
Spk+: IC1.9(GPIO7) ; port Spk+
SWCLK: IC1.24(SWCLK) ; port IO.SWCLK
SWDIO: IC1.25(SWDIO) ; port IO.SWDIO
U0RX: IC1.3(GPIO1) ; port Serial0.FCRX
U0TX: IC1.2(GPIO0) ; port Serial0.FCTX
U1RX: IC1.12(GPIO9) ; port Serial1.FCRX
U1TX: IC1.11(GPIO8) ; port Serial1.FCTX
Vbat_ADC: IC1.41(GPIO29/ADC3) ; port VI_ADC.Vbat
NetC23_2: C23.2 C25.2 IC1.23(DVDD_1) IC1.45(VREG_VOUT) IC1.50(DVDD_2)
NetIC1_20: IC1.20(XIN) Y1.3(OUT)
NetIC1_51: IC1.51(QSPI_SD3) ; port QSPI.SD3
NetIC1_52: IC1.52(QSPI_SCLK) ; port QSPI.SCLK
NetIC1_53: IC1.53(QSPI_SD0) ; port QSPI.SD0
NetIC1_54: IC1.54(QSPI_SD2) ; port QSPI.SD2
NetIC1_55: IC1.55(QSPI_SD1) ; port QSPI.SD1
NetIC1_56: IC1.56(QSPI_SS_N) ; port BOOTSEL, port QSPI.SS

Not connected (* = marked no-connect by the designer): IC1 21(XOUT)*; Y1 1(OE)*

### Layout directives
differential pair: D_N, D_P

### Library data of the parts
C23 C25-C27 C39 = 885012205086: WCAP-CSGP Multilayer Ceramic Chip Capacitor, General Purpose, size 0402, X7R, 100nF, 50VDC; Manufacturer: Wurth Elektronik; Case/Size Code: 0402; Capacitance Tolerance: +/-10%; Dissipation Factor: 10%; Insulation Resistance: 0.5GΩ; Rated Voltage (DC): 50V; Technical Reference: X7R0402104K050DFCT10000; Manufacturer Part Number: 885012205086; Category: Multilayer Ceramic Chip Capacitors; Match Code: WCAP-CSGP; ComponentLink1Description: Website Link; ComponentLink1URL: https://www.we-online.com/redexpert/article/885012205086?ad; ComponentLink2Description: Datasheet Link; ComponentLink2URL: https://www.we-online.com/redexpert/spec/885012205086?ad; Mount: Surface Mount; Operating Temperature Max: 125°C; Operating Temperature Min: -55°C; Packaging: Tape and Reel; Length: 1mm; Width: 0.5mm; Height: 0.5mm; Capacitance: 100nF; Ceramic Type: X7R
C28-C30 C36 = 885012206095: as C31 on sheet ELRS; Manufacturer Part Number: 885012206095; Category: Multilayer Ceramic Chip Capacitors; Match Code: WCAP-CSGP; ComponentLink1Description: Website Link; ComponentLink1URL: https://www.we-online.com/redexpert/article/885012206095?ad; ComponentLink2Description: Datasheet Link; ComponentLink2URL: https://www.we-online.com/redexpert/spec/885012206095?ad; Mount: Surface Mount; Operating Temperature Max: 125°C; Operating Temperature Min: -55°C; Packaging: Tape and Reel; Length: 1.6mm; Width: 0.8mm; Height: 0.8mm; Capacitance: 100nF; Ceramic Type: X7R
IC1 = RP2040: Microcontroller; Manufacturer_Name: RASPBERRY-PI; Manufacturer_Part_Number: SC0914(13); Datasheet Link: https://datasheets.raspberrypi.com/rp2040/rp2040-datasheet.pdf; Height: 0.9mm; Mouser Part Number: 358-SC091413; Mouser Price/Stock: https://www.mouser.co.uk/ProductDetail/Raspberry-Pi/SC091413?qs=T%252BzbugeAwjhr%252BUbBr3TJcw%3D%3D
R26 R30 = Res 4k7: Chipwiderstand, SMD, Baureihe MC, 5%; Manufacturer: Multicomp; PackageReference: 0603; Value: 4K7; OC_FARNELL: 9332154
Y1 = 2016 Oscillator: YXC OT201612MJBA4SL; Manufacturer_Name: Microchip; Manufacturer_Part_Number: DSC6003MA3B-032K768; Datasheet Link: https://www.mouser.es/datasheet/2/268/DSC60xxB-Ultra-Small-Ultra-Low-Power-MEMS-Oscillat-1660527.pdf; Height: 0.89mm; Mouser Part Number: 579-6003MA3B032K768; Mouser Price/Stock: https://www.mouser.co.uk/ProductDetail/Microchip-Technology/DSC6003MA3B-032K768?qs=PqoDHHvF64%252BWTEYTiC%2Fvdw%3D%3D

## Sheet SD.SchDoc
size A4; SheetNumber: 10; SheetTotal: 13
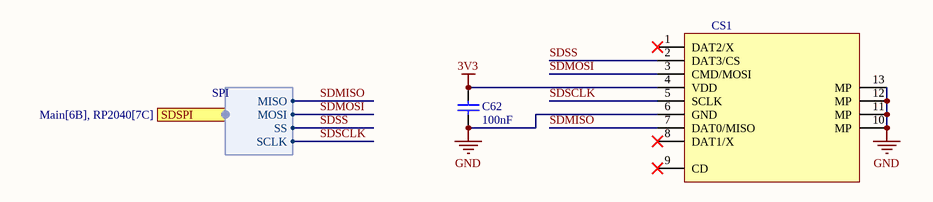
[diagram p5: SD.SchDoc]

### Parts
C62  100nF  [WCAP-CSGP_0603_L1.6W0.8H0.8_Reflow]
CS1  MicroSD TF Card  [MicroSD TF Card Slot]  (value not drawn)

### Ports
SDSPI (harness SPI, see Main[6B], RP2040[7C])

### Harnesses
SPI: MISO, MOSI, SS, SCLK

### Nets
3V3: C62.2 CS1.4(VDD)
GND: C62.1 CS1.6(GND) CS1.10(MP) CS1.11(MP) CS1.12(MP) CS1.13(MP)
SDMISO: CS1.7(DAT0/MISO) ; port SDSPI.MISO
SDMOSI: CS1.3(CMD/MOSI) ; port SDSPI.MOSI
SDSCLK: CS1.5(SCLK) ; port SDSPI.SCLK
SDSS: CS1.2(DAT3/CS) ; port SDSPI.SS  [project net SD_SS]

Not connected (* = marked no-connect by the designer): CS1 1(DAT2/X)* 8(DAT1/X)* 9(CD)*

### Library data of the parts
C62 = 885012206095: as C31 on sheet ELRS; Manufacturer Part Number: 885012206095; Category: Multilayer Ceramic Chip Capacitors; Match Code: WCAP-CSGP; ComponentLink1Description: Website Link; ComponentLink1URL: https://www.we-online.com/redexpert/article/885012206095?ad; ComponentLink2Description: Datasheet Link; ComponentLink2URL: https://www.we-online.com/redexpert/spec/885012206095?ad; Mount: Surface Mount; Operating Temperature Max: 125°C; Operating Temperature Min: -55°C; Packaging: Tape and Reel; Length: 1.6mm; Width: 0.8mm; Height: 0.8mm; Capacitance: 100nF; Ceramic Type: X7R
CS1 = MicroSD TF Card: SHOU HAN TF-CARD H1.8

## Sheet USB.SchDoc
size A4; SheetNumber: 11; SheetTotal: 13
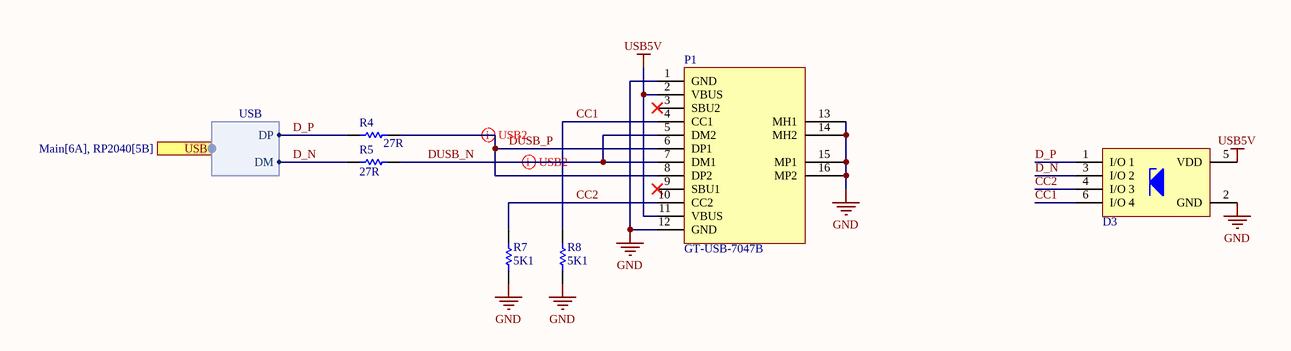
[diagram p6: USB.SchDoc]

### Parts
D3  3.3V  [WE-TVS_SOT23-6L]  (value not drawn)
P1  GT-USB-7047B  [GT-USB-7047B]
R4  27R  [0402 resistor]
R5  27R  [0402 resistor]
R7  5K1  [0402 resistor]
R8  5K1  [0402 resistor]

### Ports
USB (harness USB, see Main[6A], RP2040[5B])

### Harnesses
USB: DP, DM

### Nets
GND: D3.2(GND) P1.1(GND) P1.12(GND) P1.13(MH1) P1.14(MH2) P1.15(MP1) P1.16(MP2) R7.1 R8.1
USB5V: D3.5(VDD) P1.2(VBUS) P1.11(VBUS)
CC1: D3.6(I/O_4) P1.4(CC1) R8.2
CC2: D3.4(I/O_3) P1.10(CC2) R7.2
D_N: D3.3(I/O_2) R5.2 ; port USB.DM
D_P: D3.1(I/O_1) R4.2 ; port USB.DP
DUSB_N: P1.5(DM2) P1.7(DM1) R5.1
DUSB_P: P1.6(DP1) P1.8(DP2) R4.1

Not connected (* = marked no-connect by the designer): P1 3(SBU2)* 9(SBU1)*

### Layout directives
differential pair: DUSB_N, DUSB_P

### Library data of the parts
D3 = 824015043: WE-TVS TVS Diode – High Speed Series, SOT23-6L, 4+1 Channel, 3.3V, 2pF; Manufacturer: Wurth Elektronik; Channel ESD Clamping Voltage: 7.5V; Channel Reverse Leakage Current: 1µA; ESD Air Discharge Capability: 30kV; Polarity: Unidirectional; (Reverse) Breakdown Voltage: 4.5V; (Reverse) Peak Pulse Current: 30A; ComponentLink1Description: Website Link; ComponentLink1URL: https://www.we-online.com/redexpert/article/824015043?ad; ComponentLink2Description: Datasheet Link; ComponentLink2URL: https://www.we-online.com/redexpert/spec/824015043?ad; Manufacturer Part Number: 824015043; Category: ESD Protection; Match Code: WE-TVS; Mount: Surface Mount; Operating Temperature Max: 125°C; Operating Temperature Min: -55°C; Packaging: Tape and Reel; Case/Size Code: SOT23-6L; Length: 2.9mm; Width: 2.8mm; Height: 1.45mm; Channel Input Capacitance: 2pF; Channel Operating Voltage: 3.3V; ESD Contact Discharge Capability: 30kV; Number of Channels: 4+1
R4 R5 R7 R8 = Resistor 0402 1K
  R4 R5: Value: 27R
  R7 R8: Value: 5K1

## Sheet Voltage Regulators.SchDoc
size A4; SheetNumber: 13; SheetTotal: 13; SPICEModelCacheFXTNRSHI: <root> / <DocumentId>FXTNRSHI</DocumentId> / <CacheFrame Number="0"> / <Model Name="1206_885012108012_47uf" Kind="CKT"> / <Text>******* / .subckt 1206_885012108012_47uF 1 2 / Rser 1 3 0.0027428064885 / Lser 2 4 0.0000000008 / C1 3 4 0.000047 / Rpar 3 4 1000000 / .ends 1206_885012108012_47uF</Text> / </Model> / <Model Name="1210_885012209074_22uf" Kind="CKT"> / <Text>******* / .subckt 1210_885012209074_22uF 1 2 / Rser 1 3 0.0043 / Lser 2 4 0.000000001 / C1 3 4 0.000022 / Rpar 3 4 5000000 / .ends 1210_885012209074_22uF</Text> / </Model> / </CacheFrame> / </root>
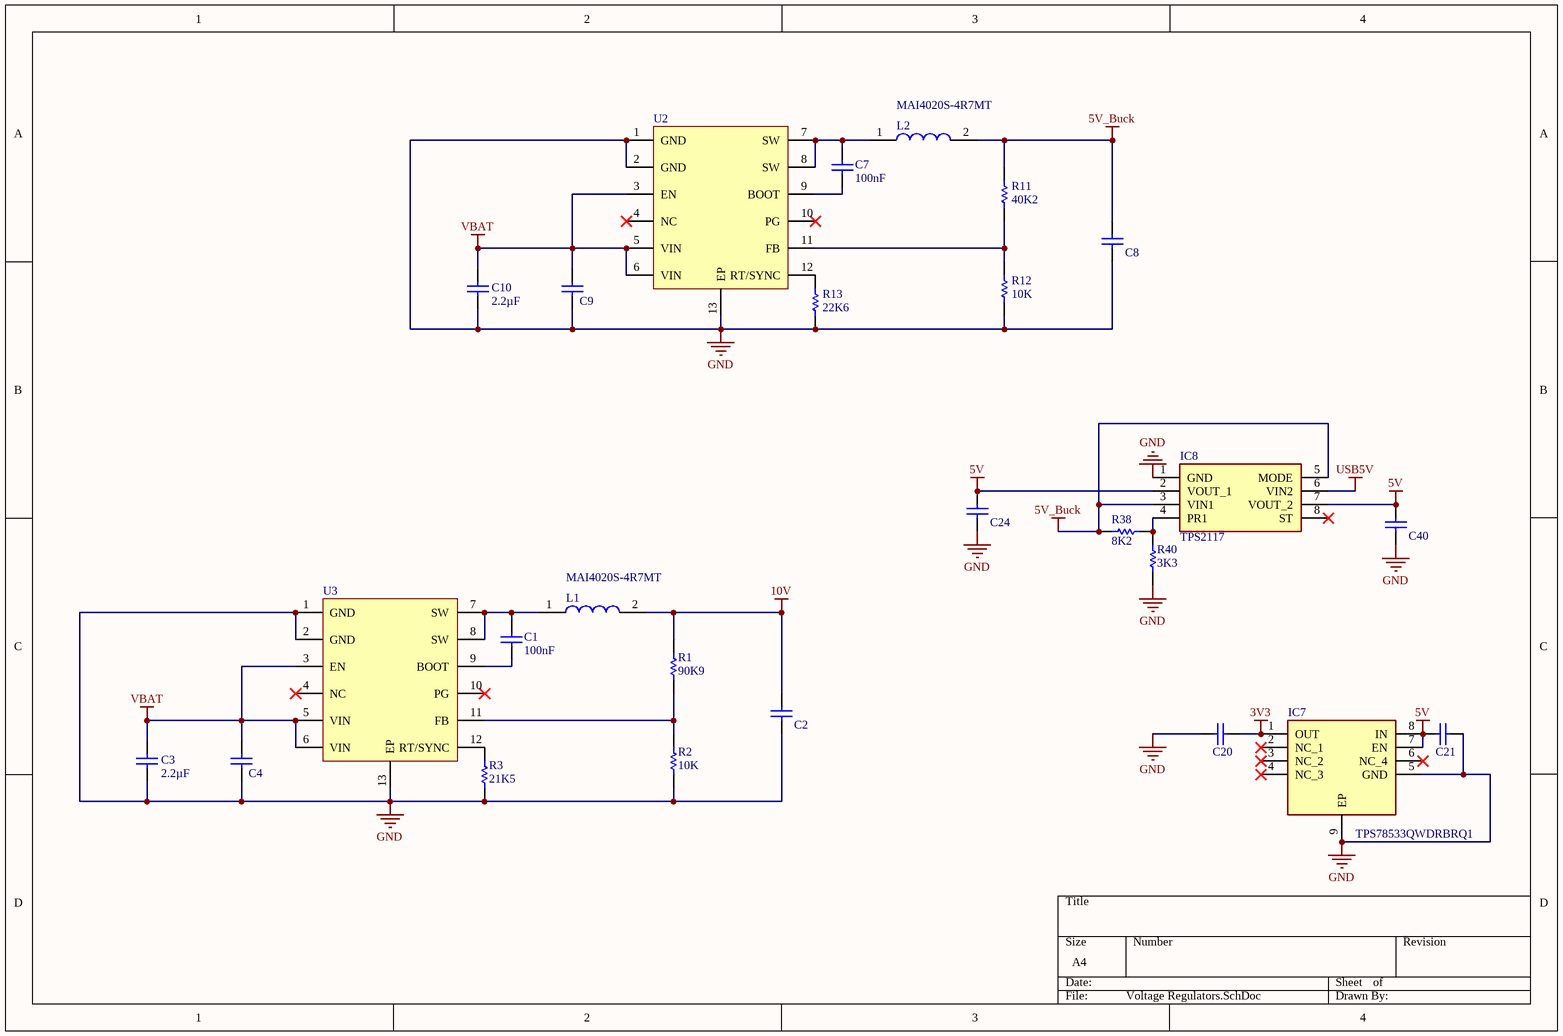
[diagram p7: Voltage Regulators.SchDoc]

### Parts
C1  100nF  [0402 cap]
C2  22µF  [WCAP-CSGP_1210_L3.2W2.5H2.5]  (value not drawn)
C3  2.2µF  [WCAP-CSGP_1206_L3.2W1.6H1.6]
C4  100nF  [WCAP-CSGP_0603_L1.6W0.8H0.8_Reflow]  (value not drawn)
C7  100nF  [0402 cap]
C8  47µF  [WCAP-CSGP_1206_L3.2W1.6H1.6]  (value not drawn)
C9  100nF  [WCAP-CSGP_0603_L1.6W0.8H0.8_Reflow]  (value not drawn)
C10  2.2µF  [WCAP-CSGP_1206_L3.2W1.6H1.6]
C20  1µF  [WCAP-CSGP_0603_L1.6W0.8H0.8_Reflow]  (value not drawn)
C21  1µF  [WCAP-CSGP_0603_L1.6W0.8H0.8_Reflow]  (value not drawn)
C24  1µF  [WCAP-CSGP_0603_L1.6W0.8H0.8_Reflow]  (value not drawn)
C40  1µF  [WCAP-CSGP_0603_L1.6W0.8H0.8_Reflow]  (value not drawn)
IC7  TPS78533QWDRBRQ1  [SON65P300X300X100-9N-D]
IC8  TPS2117  [SOTFL50P160X60-8N]
L1  MAI4020S-4R7MT  [MAI4020S-4R7MT]
L2  MAI4020S-4R7MT  [MAI4020S-4R7MT]
R1  90K9  [0402 resistor]
R2  10K  [0402 resistor]
R3  21K5  [0402 resistor]
R11  40K2  [RESC0603(1608)_N]
R12  10K  [RESC0603(1608)_N]
R13  22K6  [RESC0603(1608)_N]
R38  8K2  [0402 resistor]
R40  3K3  [0402 resistor]
U2  2.5A Step Down QFN synchronous  [LMR38025]  (value not drawn)
U3  2.5A Step Down QFN synchronous  [LMR38025]  (value not drawn)

### Nets
3V3: C20.2 IC7.1(OUT)
5V: C21.1 C24.2 C40.2 IC7.7(EN) IC7.8(IN) IC8.2(VOUT_1) IC8.7(VOUT_2)
5V_Buck: C8.2 IC8.3(VIN1) IC8.5(MODE) L2.2 R11.2 R38.1
10V: C2.2 L1.2 R1.2
GND: C2.1 C3.1 C4.1 C8.1 C9.1 C10.1 C20.1 C21.2 C24.1 C40.1 IC7.5(GND) IC7.9(EP) IC8.1(GND) R2.1 R3.1 R12.1 R13.1 R40.1 U2.1(GND) U2.2(GND) U2.13(EP) U3.1(GND) U3.2(GND) U3.13(EP)
USB5V: IC8.6(VIN2)
VBAT: C3.2 C4.2 C9.2 C10.2 U2.3(EN) U2.5(VIN) U2.6(VIN) U3.3(EN) U3.5(VIN) U3.6(VIN)
NetC1_1: C1.1 U3.9(BOOT)
NetC1_2: C1.2 L1.1 U3.7(SW) U3.8(SW)
NetC7_1: C7.1 U2.9(BOOT)
NetC7_2: C7.2 L2.1 U2.7(SW) U2.8(SW)
NetIC8_4: IC8.4(PR1) R38.2 R40.2
NetR1_1: R1.1 R2.2 U3.11(FB)
NetR3_2: R3.2 U3.12(RT/SYNC)
NetR11_1: R11.1 R12.2 U2.11(FB)
NetR13_2: R13.2 U2.12(RT/SYNC)

Not connected (* = marked no-connect by the designer): IC7 2(NC_1)* 3(NC_2)* 4(NC_3)* 6(NC_4)*; IC8 8(ST)*; U2 4(NC)* 10(PG)*; U3 4(NC)* 10(PG)*

### Library data of the parts
C1 C7 = Capacitor 0402 100nF: Value: 100nF
C2 = 885012209074: WCAP-CSGP Multilayer Ceramic Chip Capacitor, General Purpose, size 1210, X7R, 22µF, 25VDC; Manufacturer: Wurth Elektronik; Case/Size Code: 1210; Capacitance Tolerance: +/10%; Dissipation Factor: 10%; Insulation Resistance: 0.005GΩ; Rated Voltage (DC): 25V; Technical Reference: X7R1210226K025DFCT10000; Manufacturer Part Number: 885012209074; Category: Multilayer Ceramic Chip Capacitors; Match Code: WCAP-CSGP; ComponentLink1Description: Website Link; ComponentLink1URL: https://www.we-online.com/redexpert/article/885012209074?ad; ComponentLink2Description: Datasheet Link; ComponentLink2URL: https://www.we-online.com/redexpert/spec/885012209074?ad; Mount: Surface Mount; Operating Temperature Max: 125°C; Operating Temperature Min: -55°C; Packaging: Tape and Reel; Length: 3.2mm; Width: 2.5mm; Height: 2.5mm; Capacitance: 22µF; Ceramic Type: X7R
C3 C10 = 885012208124: WCAP-CSGP Multilayer Ceramic Chip Capacitor, General Purpose, size 1206, X7R, 2.2µF, 100VDC; Manufacturer: Wurth Elektronik; Case/Size Code: 1206; Capacitance Tolerance: +/-10%; Dissipation Factor: 5%; Insulation Resistance: 0.05GΩ; Rated Voltage (DC): 100V; Technical Reference: X7R1206225K100DFCT10000; Manufacturer Part Number: 885012208124; Category: Multilayer Ceramic Chip Capacitors; Match Code: WCAP-CSGP; ComponentLink1Description: Website Link; ComponentLink1URL: https://www.we-online.com/redexpert/article/885012208124?ad; ComponentLink2Description: Datasheet Link; ComponentLink2URL: https://www.we-online.com/redexpert/spec/885012208124?ad; Mount: Surface Mount; Operating Temperature Max: 125°C; Operating Temperature Min: -55°C; Packaging: Tape and Reel; Length: 3.2mm; Width: 1.6mm; Height: 1.6mm; Capacitance: 2.2µF; Ceramic Type: X7R
C4 C9 = 885012206095: as C31 on sheet ELRS; Manufacturer Part Number: 885012206095; Category: Multilayer Ceramic Chip Capacitors; Match Code: WCAP-CSGP; ComponentLink1Description: Website Link; ComponentLink1URL: https://www.we-online.com/redexpert/article/885012206095?ad; ComponentLink2Description: Datasheet Link; ComponentLink2URL: https://www.we-online.com/redexpert/spec/885012206095?ad; Mount: Surface Mount; Operating Temperature Max: 125°C; Operating Temperature Min: -55°C; Packaging: Tape and Reel; Length: 1.6mm; Width: 0.8mm; Height: 0.8mm; Capacitance: 100nF; Ceramic Type: X7R
C8 = 885012108012: WCAP-CSGP Multilayer Ceramic Chip Capacitor, General Purpose, size 1206, X5R, 47µF, 10VDC; Manufacturer: Wurth Elektronik; Case/Size Code: 1206; Capacitance Tolerance: +/-20%; Dissipation Factor: 10%; Insulation Resistance: 0.002GΩ; Rated Voltage (DC): 10V; Technical Reference: X5R1206476M010DFCT10000; Manufacturer Part Number: 885012108012; Category: Multilayer Ceramic Chip Capacitors; Match Code: WCAP-CSGP; ComponentLink1Description: Website Link; ComponentLink1URL: https://www.we-online.com/redexpert/article/885012108012?ad; ComponentLink2Description: Datasheet Link; ComponentLink2URL: https://www.we-online.com/redexpert/spec/885012108012?ad; Mount: Surface Mount; Operating Temperature Max: 85°C; Operating Temperature Min: -55°C; Packaging: Tape and Reel; Length: 3.2mm; Width: 1.6mm; Height: 1.6mm; Capacitance: 47µF; Ceramic Type: X5R
C20 C21 = 885012206026: WCAP-CSGP Multilayer Ceramic Chip Capacitor, General Purpose, size 0603, X7R, 1µF, 10VDC; Manufacturer: Wurth Elektronik; Case/Size Code: 0603; Capacitance Tolerance: +/-10%; Dissipation Factor: 10%; Insulation Resistance: 0.1GΩ; Rated Voltage (DC): 10V; Technical Reference: X7R0603105K010DFCT10000; ComponentLink1Description: Website Link; ComponentLink1URL: https://www.we-online.com/redexpert/article/885012206026?ad; ComponentLink2Description: Datasheet Link; ComponentLink2URL: https://www.we-online.com/redexpert/spec/885012206026?ad; Manufacturer Part Number: 885012206026; Category: Multilayer Ceramic Chip Capacitors; Match Code: WCAP-CSGP; Mount: Surface Mount; Operating Temperature Max: 125°C; Operating Temperature Min: -55°C; Packaging: Tape and Reel; Length: 1.6mm; Width: 0.8mm; Height: 0.8mm; Capacitance: 1µF; Ceramic Type: X7R
C24 C40 = 885012106017: WCAP-CSGP Multilayer Ceramic Chip Capacitor, General Purpose, size 0603, X5R, 1µF, 16VDC; Manufacturer: Wurth Elektronik; Case/Size Code: 0603; Capacitance Tolerance: +/-20%; Dissipation Factor: 10%; Insulation Resistance: 0.1GΩ; Rated Voltage (DC): 16V; Technical Reference: X5R0603105M016DFCT10000; ComponentLink1Description: Website Link; ComponentLink1URL: https://www.we-online.com/redexpert/article/885012106017?ad; ComponentLink2Description: Datasheet Link; ComponentLink2URL: https://www.we-online.com/redexpert/spec/885012106017?ad; Manufacturer Part Number: 885012106017; Category: Multilayer Ceramic Chip Capacitors; Match Code: WCAP-CSGP; Mount: Surface Mount; Operating Temperature Max: 85°C; Operating Temperature Min: -55°C; Packaging: Tape and Reel; Length: 1.6mm; Width: 0.8mm; Height: 0.8mm; Capacitance: 1µF; Ceramic Type: X5R
IC7 = TPS78533QWDRBRQ1: Integrated Circuit; Manufacturer_Name: Texas Instruments; Datasheet Link: https://www.arrow.com/en/products/tps78533qwdrbrq1/texas-instruments?region=nac; Height: 1mm; Manufacturer_Part_Number: TPS78533QWDRBRQ1; Mouser Part Number: 595-TPS78533QWDRBRQ1; Mouser Price/Stock: https://www.mouser.co.uk/ProductDetail/Texas-Instruments/TPS78533QWDRBRQ1?qs=iLbezkQI%252BsiNbdqh2Ko9GQ%3D%3D; Arrow Part Number: TPS78533QWDRBRQ1; Arrow Price/Stock: https://www.arrow.com/en/products/tps78533qwdrbrq1/texas-instruments?region=nac
IC8 = TPS2116DRLR: Integrated Circuit; Manufacturer_Name: Texas Instruments; Datasheet Link: https://www.ti.com/lit/gpn/tps2116; Height: 0.6mm; Manufacturer_Part_Number: TPS2116DRLR; Mouser Part Number: 595-TPS2116DRLR; Mouser Price/Stock: https://www.mouser.co.uk/ProductDetail/Texas-Instruments/TPS2116DRLR?qs=aP1CjGhiNiGo3XAyXcVPaQ%3D%3D; Arrow Part Number: TPS2116DRLR; Arrow Price/Stock: https://www.arrow.com/en/products/tps2116drlr/texas-instruments?region=nac
R1-R3 R38 R40 = Resistor 0402 1K
  R1: Value: 90K9
  R2: Value: 10K
  R3: Value: 21K5
  R38: Value: 8K2
  R40: Value: 3K3
R11-R13 = Res 33K: Chipwiderstand, SMD, Baureihe MC, 1%; Manufacturer: Multicomp; PackageReference: 0603; OC_FARNELL: 9331506
  R11: Value: 40K2
  R12: Value: 10K
  R13: Value: 22K6
U2 U3 = LMR38025: LMR38025-Q1 SIMPLE SWITCHER® Power Converter, 4.2-V to 80-V, 2.5-A Automotive / Synchronous Buck Converter With 40-μA IQ

## Nets that join several sheets
3V3: Baro (C17.2 PS1.6 PS1.8), Connectors (IC13.6 P5.1 P5.2), ELRS (32 pins), OSD (B1.2 B2.2), RP2040 (20 pins), SD (C62.2 CS1.4), Voltage Regulators (C20.2 IC7.1)
5V: Connectors (7 pins), ELRS (D1.2), OSD (B2.3), Voltage Regulators (7 pins)
10V: Connectors (J3.1 P28.1 P28.2), Voltage Regulators (C2.2 L1.2 R1.2)
GND: Baro (C17.1 PS1.1 PS1.7), Connectors (22 pins), ELRS (80 pins), OSD (10 pins), RP2040 (12 pins), SD (6 pins), USB (9 pins), Voltage Regulators (24 pins)
USB5V: USB (D3.5 P1.2 P1.11), Voltage Regulators (IC8.6)
VBAT: Connectors (P2.2 P32.1), Voltage Regulators (10 pins)
Activity: Connectors (P36.1), RP2040 (IC1.14)
BARO_SS: Baro (PS1.2), RP2040 (IC1.39)
BaroMISO: Baro (PS1.5), OSD (IC4.11), RP2040 (IC1.27)
BaroMOSI: Baro (PS1.3), OSD (IC4.9), RP2040 (IC1.30)
BaroSCLK: Baro (PS1.4), OSD (IC4.10), RP2040 (IC1.29)
D_N: RP2040 (IC1.46), USB (D3.3 R5.2)
D_P: RP2040 (IC1.47), USB (D3.1 R4.2)
Debug: Connectors (P34.1), RP2040 (IC1.13)
IO2: Connectors (P8.1 P8.2), RP2040 (IC1.4)
IO3: Connectors (P9.1 P9.2), RP2040 (IC1.5)
IO4: Connectors (P3.1 P3.2), RP2040 (IC1.6)
IO5: Connectors (P2.7 P4.1), RP2040 (IC1.7)
IO24: Connectors (J2.2 P7.1 P7.2), RP2040 (IC1.36 R26.1)
IO25: Connectors (J2.1 P6.1 P6.2), RP2040 (IC1.37 R30.1)
M1: Connectors (P2.3 P16.1), RP2040 (IC1.31)
M2: Connectors (P2.4 P17.1), RP2040 (IC1.32)
M3: Connectors (P2.5 P18.1), RP2040 (IC1.34)
M4: Connectors (P2.6 P19.1), RP2040 (IC1.35)
OSD_SS: OSD (IC4.8), RP2040 (IC1.16)
SD_SS: RP2040 (IC1.28), SD (CS1.2)
SDMISO: RP2040 (IC1.15), SD (CS1.7)
SDMOSI: RP2040 (IC1.18), SD (CS1.3)
SDSCLK: RP2040 (IC1.17), SD (CS1.5)
SWCLK: Connectors (P37.1), RP2040 (IC1.24)
SWDIO: Connectors (P35.1), RP2040 (IC1.25)
U0RX: Connectors (P14.1), RP2040 (IC1.3)
U0TX: Connectors (P15.1), RP2040 (IC1.2)
U1RX: Connectors (J3.4 P12.1 P12.2), RP2040 (IC1.12)
U1TX: Connectors (J3.3 P13.1 P13.2), RP2040 (IC1.11)
Video In: Connectors (P11.1 P11.2), OSD (C13.2 R21.1)
Video Out: Connectors (P10.1 P10.2), OSD (R9.1)